# EAGLE design new_uvbox (EAGLE 7.6.0)
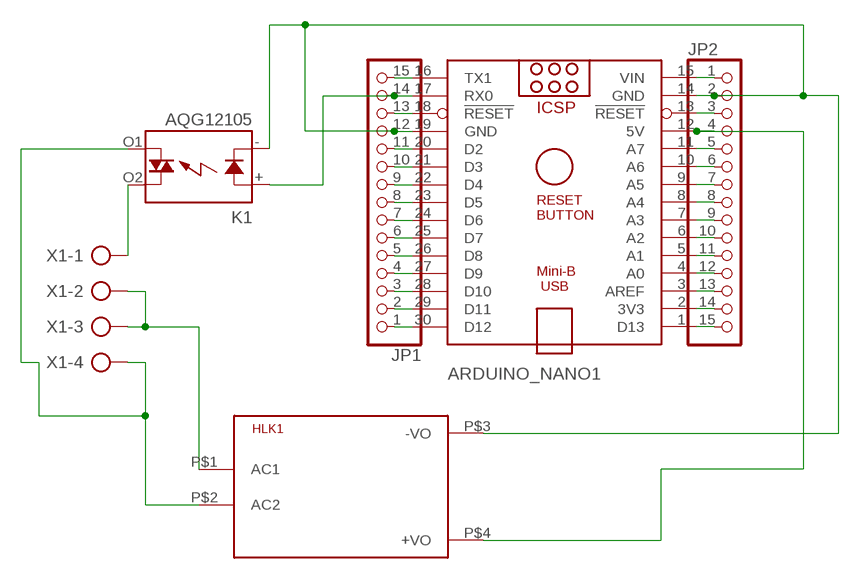
[diagram p0: schematic, sheet 1]

## Parts
ARDUINO_NANO1  ARDUINO_NANO  [ARDUINO_NANO]
HLK1  HLK-PM013W  [HLK-PM01]
JP1  PINHD-1X15  [1X15]
JP2  PINHD-1X15  [1X15]
K1  AQG12105  [AQG]
X1  AK300/4  [AK300/4]

## Nets
N$1: ARDUINO_NANO1.16(TX1) JP1.15
N$2: ARDUINO_NANO1.17(RX0) JP1.14 K1.+(A)
N$3: ARDUINO_NANO1.18(!RESET) JP1.13
N$4: ARDUINO_NANO1.14(GND) ARDUINO_NANO1.19(GND) HLK1.P$3(-VO) JP1.12 JP2.2 K1.-(K)
N$5: ARDUINO_NANO1.30(D12) JP1.1
N$6: ARDUINO_NANO1.29(D11) JP1.2
N$7: ARDUINO_NANO1.28(D10) JP1.3
N$8: ARDUINO_NANO1.27(D9) JP1.4
N$9: ARDUINO_NANO1.26(D8) JP1.5
N$10: ARDUINO_NANO1.25(D7) JP1.6
N$11: ARDUINO_NANO1.24(D6) JP1.7
N$12: ARDUINO_NANO1.23(D5) JP1.8
N$13: ARDUINO_NANO1.22(D4) JP1.9
N$14: ARDUINO_NANO1.21(D3) JP1.10
N$15: ARDUINO_NANO1.20(D2) JP1.11
N$16: ARDUINO_NANO1.15(VIN) JP2.1
N$17: HLK1.P$2(AC2) K1.O1(DS2) X1.4
N$18: ARDUINO_NANO1.13(!RESET) JP2.3
N$19: ARDUINO_NANO1.12(5V) HLK1.P$4(+VO) JP2.4
N$20: ARDUINO_NANO1.11(A7) JP2.5
N$21: ARDUINO_NANO1.10(A6) JP2.6
N$22: ARDUINO_NANO1.9(A5) JP2.7
N$23: ARDUINO_NANO1.8(A4) JP2.8
N$24: ARDUINO_NANO1.7(A3) JP2.9
N$25: ARDUINO_NANO1.6(A2) JP2.10
N$26: ARDUINO_NANO1.5(A1) JP2.11
N$27: ARDUINO_NANO1.4(A0) JP2.12
N$28: ARDUINO_NANO1.3(AREF) JP2.13
N$29: ARDUINO_NANO1.2(3V3) JP2.14
N$30: ARDUINO_NANO1.1(D13) JP2.15
N$31: HLK1.P$1(AC1) X1.2 X1.3
N$32: K1.O2(DS1) X1.1

## Library data of the parts
ARDUINO_NANO1 = ArduinoNanoV30:ARDUINO_NANO: Arduino Nano V3.0 Overview: The Arduino Nano is a small, complete, and breadboard-friendly board based on the ATmega328 (Arduino Nano 3.x) or ATmega168 (Arduino Nano 2.x). It has more or less the same functionality of the Arduino Duemilanove, but in a different package. It lacks only a DC power jack, and works with a Mini-B USB cable instead of a standard one. The Nano was designed and is being produced by Gravitech. Specifications: Microcontroller Atmel ATmega168 or ATmega328 Operating Voltage (logic level) 5 V Input Voltage (recommended) 7-12 V Input Voltage (limits) 6-20 V Digital I/O Pins 14 (of which 6 provide PWM output) Analog Input Pins 8 DC Current per I/O Pin 40 mA Flash Memory 16 KB (ATmega168) or 32 KB (ATmega328) of which 2 KB used by bootloader SRAM 1 KB (ATmega168) or 2 KB (ATmega328) EEPROM 512 bytes (ATmega168) or 1 KB (ATmega328) Clock Speed 16 MHz Dimensions 0.73" x 1.70" Length 45 mm Width 18 mm Weigth 5 g Power: The Arduino Nano can be powered via the Mini-B USB connection, 6-20V unregulated external power supply (pin 30), or 5V regulated external power supply (pin 27). The power source is automatically selected to the highest voltage source. Memory: The ATmega168 has 16 KB of flash memory for storing code (of which 2 KB is used for the bootloader); the ATmega328 has 32 KB, (also with 2 KB used for the bootloader). The ATmega168 has 1 KB of SRAM and 512 bytes of EEPROM (which can be read and written with the EEPROM library); the ATmega328 has 2 KB of SRAM and 1 KB of EEPROM. Input and Output: Each of the 14 digital pins on the Nano can be used as an input or output, using pinMode(), digitalWrite(), and digitalRead() functions. They operate at 5 volts. Each pin can provide or receive a maximum of 40 mA and has an internal pull-up resistor (disconnected by default) of 20-50 kOhms. In addition, some pins have specialized functions. Visit Arduino - ArduinoBoardNano <https://www.arduino.cc/en/Main/ArduinoBoardNano>
HLK1 = HLK-PM01:HLK-PM01: Hi-Link Power Supply HLK-PM01 3W Author: Ahmed Said <https://github.com/AhmedSaid/EAGLELibraries>
JP1 JP2 = pinhead:PINHD-1X15: PIN HEADER
K1 = relay:AQG*: SOLID STATE RELAY NAiS Zero-cross, Non zero-cross Source: http://www.mew-europe.com/.. en_ds_61611_0000.pdf; MF: AROMAT/ MATSUSHITA; MPN: AQG12105; OC_FARNELL: unknown; OC_NEWARK: 20J4759
X1 = con-ptr500:AK300/4: CONNECTOR; OC_FARNELL: unknown; OC_NEWARK: unknown

## Board
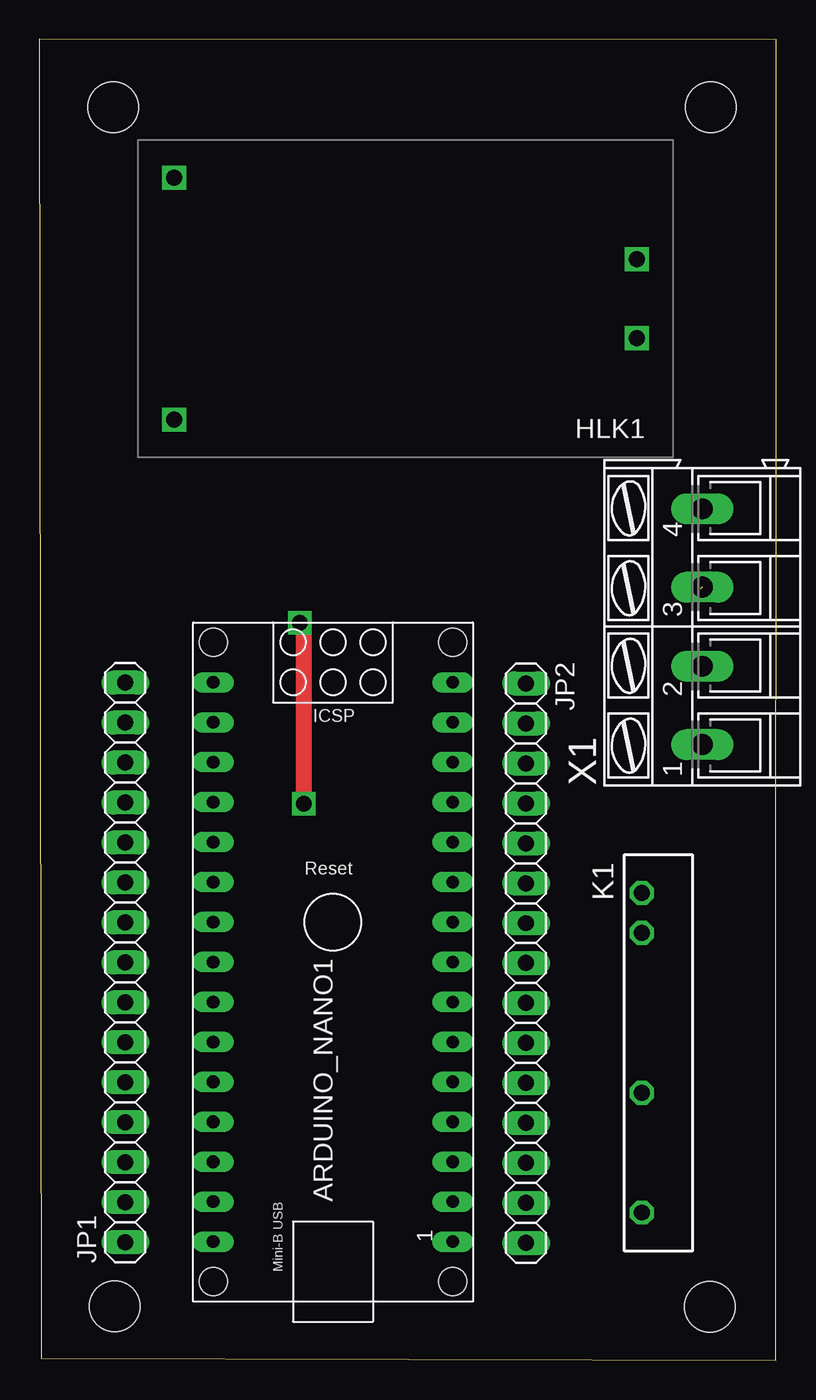
[diagram p1: board, top side]
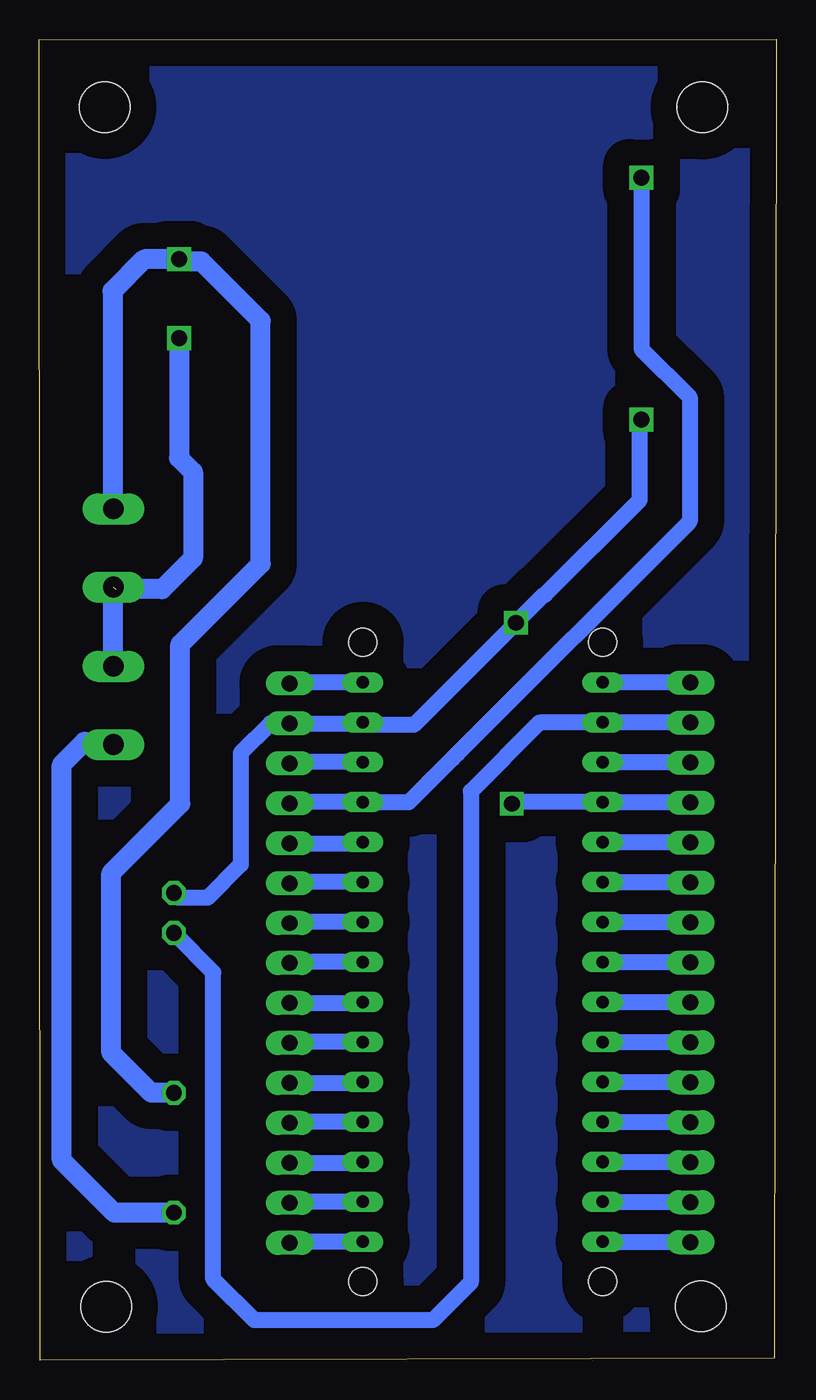
[diagram p2: board, bottom side, seen from below]

Size 46.87 x 83.96 mm. Coordinates in mm from the lower left corner, seen from the top.
Outline: 0.13,0.13 46.83,0 46.87,83.94 0,83.96 0.13,0.13
Copper layers (1*16): Top 0.035mm / dielectric 1.5mm / Bottom 0.035mm
Design rules "default": minimum track width 10mil, minimum drill 24mil, track to track 8mil, track to pad 8mil, pad to pad 8mil, via to via 8mil, smd to smd 8mil, copper to edge 40mil, drill to drill 8mil, minimum pad ring 10mil, minimum via ring 8mil, stop-mask expansion 4mil, vias tented up to drill 0mil, thermal gap 10mil
Holes 3.2 mm at 4.71,79.63 42.7,79.64 4.8,3.42 42.62,3.39

### Footprints (pad centres in the part's own frame; a part is rotated, then mirrored left to right if it is on the bottom)
ARDUINO_NANO = drill 0.8 long: 1 -20.32,-7.62; 2 -17.78,-7.62; 3 -15.24,-7.62; 4 -12.7,-7.62; 5 -10.16,-7.62; 6 -7.62,-7.62; 7 -5.08,-7.62; 8 -2.54,-7.62; 9 0,-7.62; 10 2.54,-7.62; 11 5.08,-7.62; 12 7.62,-7.62; 13 10.16,-7.62; 14 12.7,-7.62; 15 15.24,-7.62; 16 15.24,7.62; 17 12.7,7.62; 18 10.16,7.62; 19 7.62,7.62; 20 5.08,7.62; 21 2.54,7.62; 22 0,7.62; 23 -2.54,7.62; 24 -5.08,7.62; 25 -7.62,7.62; 26 -10.16,7.62; 27 -12.7,7.62; 28 -15.24,7.62; 29 -17.78,7.62; 30 -20.32,7.62 | hole 1.778: -22.86,-7.62; -22.86,7.62; 17.78,7.62; 17.78,-7.62
HLK-PM01 = drill 1.016 square: P$1 -14.7,2.5; P$2 -14.7,-2.5; P$3 14.7,7.7; P$4 14.7,-7.7
1X15 = drill 1.016 long: 1 -17.78,0; 2 -15.24,0; 3 -12.7,0; 4 -10.16,0; 5 -7.62,0; 6 -5.08,0; 7 -2.54,0; 8 0,0; 9 2.54,0; 10 5.08,0; 11 7.62,0; 12 10.16,0; 13 12.7,0; 14 15.24,0; 15 17.78,0
AQG = drill 1 octagon: + -7.62,0; - -10.16,0; O1 2.54,0; O2 10.16,0
AK300/4 = drill 1.321 long: 1 -7.493,0; 2 -2.515,0; 3 2.515,0; 4 7.493,0

### Placement (x,y rotation side)
ARDUINO_NANO1  18.67,27.85 90 top
HLK1  23.29,67.48 180 top
JP1  5.47,25.28 90 top
JP2  30.95,25.24 270 top
K1  38.31,19.54 270 top
X1  42.16,46.62 90 top

### Tracks (layer width: path | path; a pad name or v marks a point on that pad's centre or on a via)
N$1
  Bottom 1.016: JP1.15 11.05,43.06 ARDUINO_NANO1.16
N$2
  Bottom 1.016: JP1.14 11.05,40.52 | 11.05,40.52 ARDUINO_NANO1.17 | 11.05,40.52 15.07,40.52 19.44,36.16 19.44,4.95 21.84,2.54 33.19,2.54 35.8,5.16 35.8,24.65 K1.+
N$3
  Bottom 1.016: ARDUINO_NANO1.18 5.47,38.01 JP1.13
N$4  (via drill 1)
  Top 1.016: v16.82,35.37 16.82,46.62 v16.57,46.88
  Bottom 1.016: JP1.12 11.05,35.44 ARDUINO_NANO1.19 16.72,35.47 v16.82,35.37 | HLK1.P$3 8.69,59.68 8.69,54.68 14.71,48.66 14.78,48.66 v16.57,46.88 16.83,46.62 23.05,40.39 26.13,40.39 ARDUINO_NANO1.14 26.29,40.48 JP2.2 32.17,40.48 34.06,38.59 34.06,31.5 36.17,29.4 38.01,29.4 K1.-
N$5
  Bottom 1.016: JP1.1 11.05,7.5 ARDUINO_NANO1.30
N$6
  Bottom 1.016: JP1.2 11.05,10.04 ARDUINO_NANO1.29
N$7
  Bottom 1.016: ARDUINO_NANO1.28 5.47,12.61 JP1.3
N$8
  Bottom 1.016: JP1.4 11.05,15.12 ARDUINO_NANO1.27
N$9
  Bottom 1.016: JP1.5 11.05,17.66 ARDUINO_NANO1.26
N$10
  Bottom 1.016: JP1.6 11.05,20.2 ARDUINO_NANO1.25
N$11
  Bottom 1.016: ARDUINO_NANO1.24 5.47,22.77 JP1.7
N$12
  Bottom 1.016: JP1.8 11.05,25.28 ARDUINO_NANO1.23
N$13
  Bottom 1.016: ARDUINO_NANO1.22 5.47,27.85 JP1.9
N$14
  Bottom 1.016: JP1.10 11.05,30.36 ARDUINO_NANO1.21
N$15
  Bottom 1.016: ARDUINO_NANO1.20 5.47,32.93 JP1.11
N$16
  Bottom 1.016: ARDUINO_NANO1.15 30.95,43.09 JP2.1
N$17
  Bottom 1.27: X1.4 42.21,54.16 42.21,67.96 40.19,69.98 HLK1.P$2 37.85,69.84 36.55,69.84 32.78,66.08 32.78,50.62 37.9,45.51 37.9,35.36 42.3,30.96 42.3,19.54 39.75,17 K1.O1
N$18
  Bottom 1.016: ARDUINO_NANO1.13 30.95,38.01 JP2.3
N$19
  Bottom 1.016: JP2.4 30.95,35.47 ARDUINO_NANO1.12 23.36,35.47 20.59,38.24 20.27,38.56 5.52,53.32 5.52,61.21 8.59,64.28 HLK1.P$4
N$20
  Bottom 1.016: JP2.5 26.29,32.86 ARDUINO_NANO1.11
N$21
  Bottom 1.016: ARDUINO_NANO1.10 30.95,30.39 JP2.6
N$22
  Bottom 1.016: ARDUINO_NANO1.9 30.95,27.85 JP2.7
N$23
  Bottom 1.016: ARDUINO_NANO1.8 30.95,25.31 JP2.8
N$24
  Bottom 1.016: JP2.9 26.29,22.7 ARDUINO_NANO1.7
N$25
  Bottom 1.016: ARDUINO_NANO1.6 30.95,20.23 JP2.10
N$26
  Bottom 1.016: JP2.11 26.29,17.62 ARDUINO_NANO1.5
N$27
  Bottom 1.016: ARDUINO_NANO1.4 30.95,15.15 JP2.12
N$28
  Bottom 1.016: JP2.13 26.29,12.54 ARDUINO_NANO1.3
N$29
  Bottom 1.016: ARDUINO_NANO1.2 30.95,10.07 JP2.14
N$30
  Bottom 1.016: ARDUINO_NANO1.1 30.95,7.53 JP2.15
N$31  (1 unrouted)
  Bottom 1.27: HLK1.P$1 37.99,57.35 37.09,56.46 37.09,50.98 39.07,49 42.03,49 | X1.2 X1.3
N$32
  Bottom 1.27: K1.O2 42.1,9.38 45.44,12.71 45.44,37.87 44,39.3 42.33,39.3 X1.1
N$33
  pour Bottom (isolate 1.676): 0.38,83.74 46.9,83.74 46.9,0.46 0.22,0.46 0.22,83.74

### Text on the board
Dimension: LINE IN / NORMAL IN / NORMAL OUT / LINE OUT